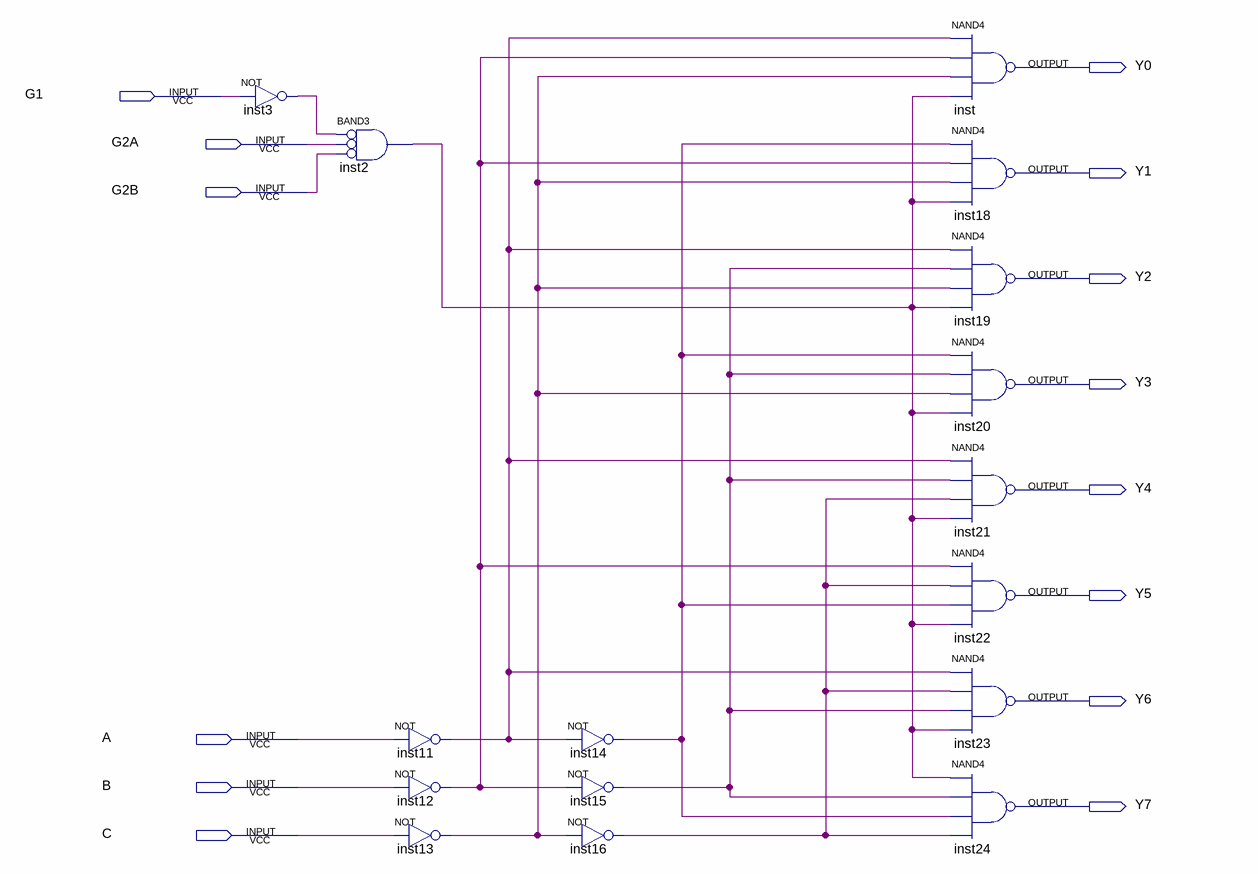
[diagram p0: schematic sheet]
// Quartus schematic 74LS138.bdf as structural Verilog: 16 symbols, 14 pins
module \74LS138  (
  input  G1,
  input  G2A,
  input  G2B,
  input  A,
  input  B,
  input  C,
  output Y0,
  output Y1,
  output Y2,
  output Y3,
  output Y4,
  output Y5,
  output Y6,
  output Y7
);

  wire inst2_out, inst3_out, inst11_out, inst12_out, inst13_out, inst14_out, inst15_out, inst16_out;

  not inst3 (inst3_out, G1);
  and inst2 (inst2_out, ~inst3_out, ~G2A, ~G2B);  // BAND3
  not inst11 (inst11_out, A);
  not inst12 (inst12_out, B);
  not inst13 (inst13_out, C);
  not inst14 (inst14_out, inst11_out);
  not inst15 (inst15_out, inst12_out);
  not inst16 (inst16_out, inst13_out);
  nand inst (Y0, inst11_out, inst12_out, inst13_out, inst2_out);
  nand inst18 (Y1, inst14_out, inst12_out, inst13_out, inst2_out);
  nand inst19 (Y2, inst11_out, inst15_out, inst13_out, inst2_out);
  nand inst20 (Y3, inst14_out, inst15_out, inst13_out, inst2_out);
  nand inst21 (Y4, inst11_out, inst15_out, inst16_out, inst2_out);
  nand inst22 (Y5, inst12_out, inst16_out, inst14_out, inst2_out);
  nand inst23 (Y6, inst11_out, inst16_out, inst15_out, inst2_out);
  nand inst24 (Y7, inst2_out, inst15_out, inst14_out, inst16_out);
endmodule
